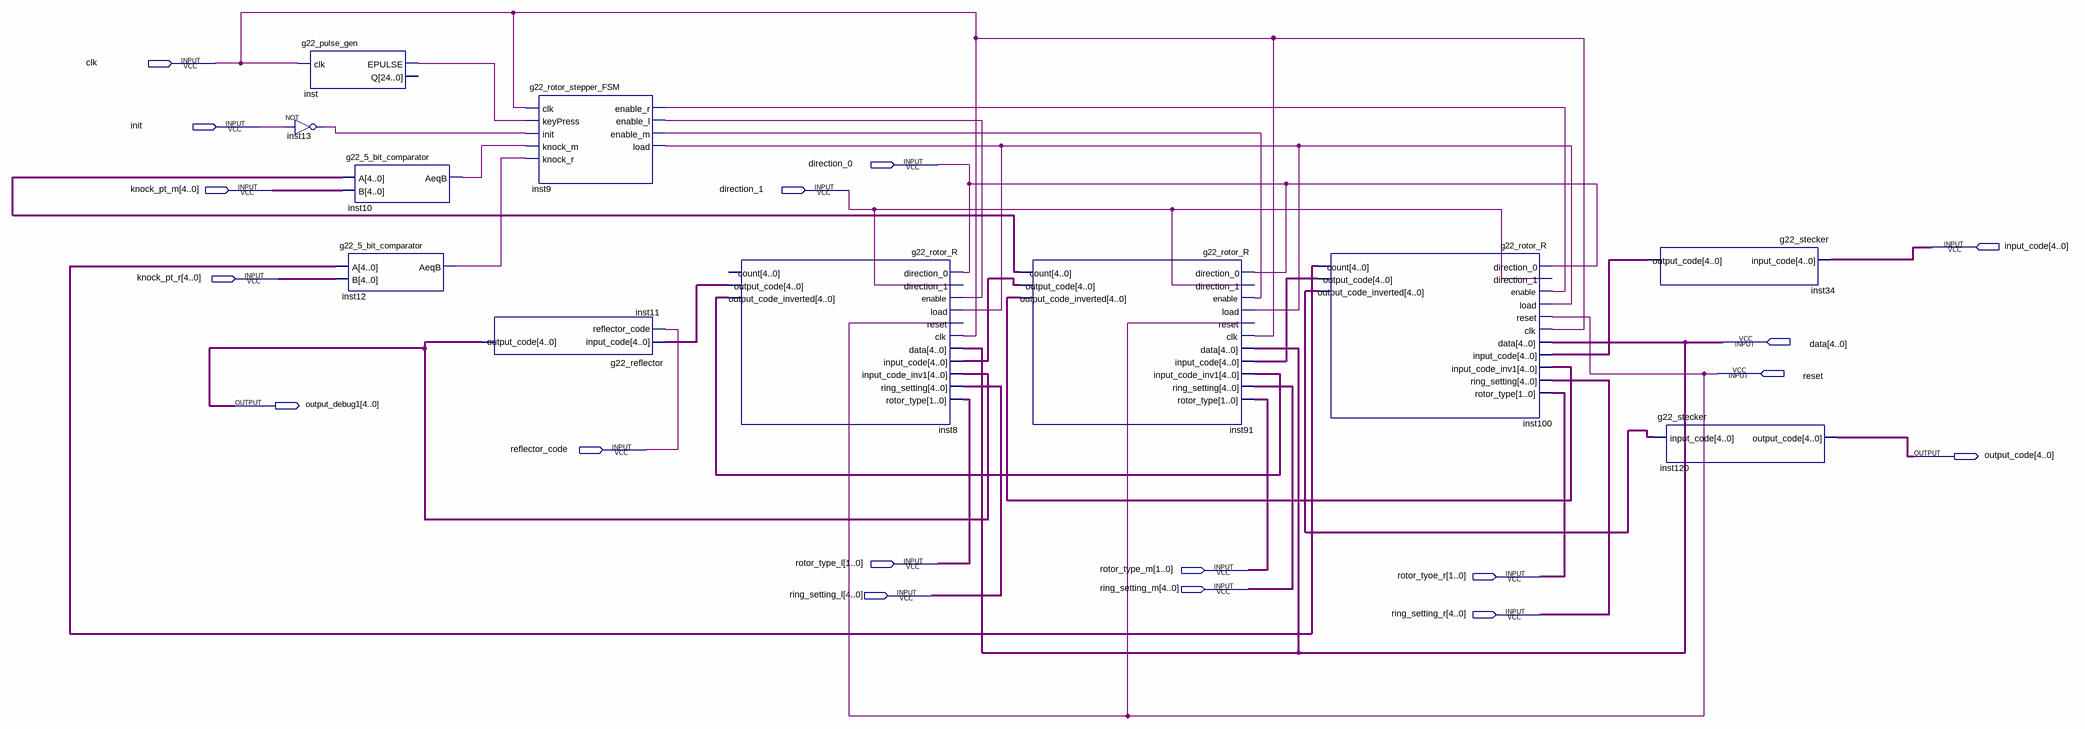
[diagram p0: schematic sheet]
// Quartus schematic g22_full_enigma.bdf as structural Verilog: 11 symbols, 18 pins
module g22_full_enigma (
  input  clk,
  input  init,
  input  direction_0,
  input  [4:0] knock_pt_m,
  input  direction_1,
  input  [4:0] input_code,
  input  [4:0] knock_pt_r,
  input  [4:0] data,
  input  reset,
  input  reflector_code,
  input  [1:0] rotor_type_l,
  input  [1:0] rotor_type_m,
  input  [1:0] rotor_tyoe_r,
  input  [4:0] ring_setting_m,
  input  [4:0] ring_setting_l,
  input  [4:0] ring_setting_r,
  output [4:0] output_debug1,
  output [4:0] output_code
);

  wire inst9_enable_l, inst9_enable_m, inst9_enable_r, inst9_load, inst10_aeqb, inst12_aeqb, inst13_out,
       inst_epulse;
  wire [4:0] inst8_output_code, inst8_output_code_inverted, inst34_output_code, inst91_count,
       inst91_output_code, inst91_output_code_inverted, inst100_count, inst100_output_code,
       inst100_output_code_inverted;

  g22_pulse_gen inst (.clk(clk), .EPULSE(inst_epulse));  // open: Q
  not inst13 (inst13_out, init);
  g22_5_bit_comparator inst10 (.A(inst91_count), .B(knock_pt_m), .AeqB(inst10_aeqb));
  g22_5_bit_comparator inst12 (.A(inst100_count), .B(knock_pt_r), .AeqB(inst12_aeqb));
  g22_reflector inst11 (.input_code(inst8_output_code), .reflector_code(reflector_code), .output_code(output_debug1));
  g22_rotor_stepper_FSM inst9 (
    .clk(clk), .keyPress(inst_epulse), .init(inst13_out), .knock_m(inst10_aeqb), .knock_r(inst12_aeqb),
    .enable_r(inst9_enable_r), .enable_l(inst9_enable_l), .enable_m(inst9_enable_m), .load(inst9_load));
  g22_rotor_R inst8 (
    .direction_0(direction_0), .direction_1(direction_1), .enable(inst9_enable_l), .load(inst9_load),
    .reset(reset), .clk(clk), .data(data), .input_code(inst91_output_code), .input_code_inv1(output_debug1),
    .ring_setting(ring_setting_l), .rotor_type(rotor_type_l), .output_code(inst8_output_code),
    .output_code_inverted(inst8_output_code_inverted));  // open: count
  g22_rotor_R inst91 (
    .direction_0(direction_0), .direction_1(direction_1), .enable(inst9_enable_m), .load(inst9_load),
    .reset(reset), .clk(clk), .data(data), .input_code(inst100_output_code),
    .input_code_inv1(inst8_output_code_inverted), .ring_setting(ring_setting_m), .rotor_type(rotor_type_m),
    .count(inst91_count), .output_code(inst91_output_code), .output_code_inverted(inst91_output_code_inverted));
  g22_rotor_R inst100 (
    .direction_0(direction_0), .direction_1(direction_1), .enable(inst9_enable_r), .load(inst9_load),
    .reset(reset), .clk(clk), .data(data), .input_code(inst34_output_code),
    .input_code_inv1(inst91_output_code_inverted), .ring_setting(ring_setting_r), .rotor_type(rotor_tyoe_r),
    .count(inst100_count), .output_code(inst100_output_code),
    .output_code_inverted(inst100_output_code_inverted));
  g22_stecker inst34 (.input_code(input_code), .output_code(inst34_output_code));
  g22_stecker inst120 (.input_code(inst100_output_code_inverted), .output_code(output_code));
endmodule
